# EAGLE schematic SimpleTimerPCB (EAGLE 6.5.0)
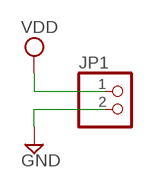
[diagram p0: schematic, sheet 1]

## Parts
JP1  PINHD-1X2  [1X02]

## Nets
GND: JP1.2
VDD: JP1.1

## Library data of the parts
JP1 = pinhead:PINHD-1X2: PIN HEADER